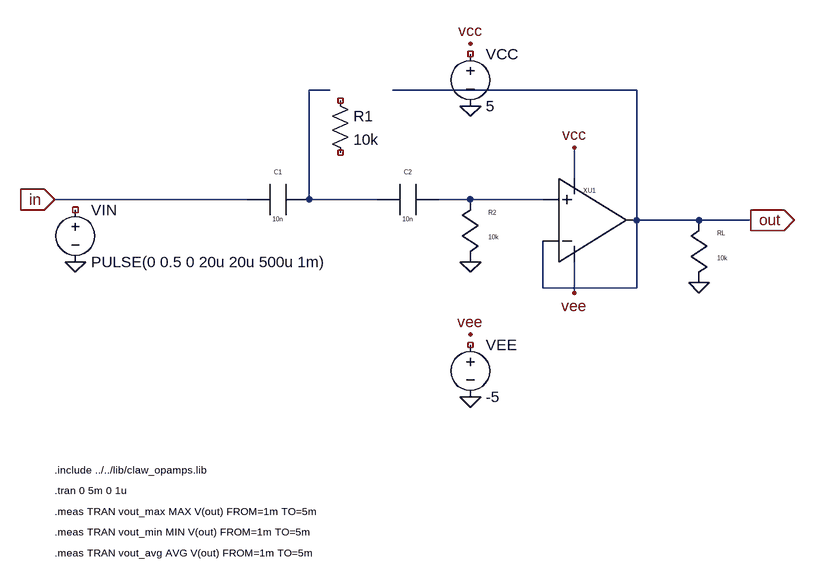
[diagram p0: schematic sallen_key_highpass.asc]
sallen_key_highpass.asc, the LTspice schematic file:
Version 4
SHEET 1 1357 1031
WIRE 64 304 360 304
WIRE 456 304 560 304
WIRE 656 304 816 304
WIRE 456 304 456 136
WIRE 456 136 488 136
WIRE 584 136 960 136
WIRE 960 136 960 336
WIRE 960 336 1136 336
WIRE 960 336 960 440
WIRE 960 440 816 440
WIRE 816 440 816 368
WIRE 864 272 864 224
WIRE 864 400 864 448
SYMBOL voltage 96 304 R0
SYMATTR InstName VIN
SYMATTR Value PULSE(0 0.5 0 20u 20u 500u 1m)
SYMBOL voltage 704 64 R0
SYMATTR InstName VCC
SYMATTR Value 5
SYMBOL voltage 704 512 R0
SYMATTR InstName VEE
SYMATTR Value -5
SYMBOL cap_h 360 304 R0
SYMATTR InstName C1
SYMATTR Value 10n
SYMBOL cap_h 560 304 R0
SYMATTR InstName C2
SYMATTR Value 10n
SYMBOL res 488 136 R0
SYMATTR InstName R1
SYMATTR Value 10k
SYMBOL res_v 704 304 R0
SYMATTR InstName R2
SYMATTR Value 10k
SYMBOL opamp2 816 272 R0
SYMATTR InstName XU1
SYMATTR Value CLAW_IDEAL_OPAMP
SYMBOL res_v 1056 336 R0
SYMATTR InstName RL
SYMATTR Value 10k
FLAG 64 304 in
IOPIN 64 304 In
FLAG 1136 336 out
IOPIN 1136 336 Out
FLAG 96 400 0
FLAG 704 400 0
FLAG 1056 432 0
FLAG 704 64 vcc
FLAG 704 160 0
FLAG 704 512 vee
FLAG 704 608 0
FLAG 864 224 vcc
FLAG 864 448 vee
TEXT 64 720 Left 1 !.include ../../lib/claw_opamps.lib
TEXT 64 752 Left 1 !.tran 0 5m 0 1u
TEXT 64 784 Left 1 !.meas TRAN vout_max MAX V(out) FROM=1m TO=5m
TEXT 64 816 Left 1 !.meas TRAN vout_min MIN V(out) FROM=1m TO=5m
TEXT 64 848 Left 1 !.meas TRAN vout_avg AVG V(out) FROM=1m TO=5m

The netlist it stands for:
* sallen_key_highpass.asc
VIN NC_01 0 PULSE(0 0.5 0 20u 20u 500u 1m)
VCC NC_02 0 5
VEE NC_03 0 -5
C1 in N001 10n
C2 N001 N002 10n
R1 NC_04 NC_05 10k
R2 N002 0 10k
XXU1 CLAW_IDEAL_OPAMP CLAW_IDEAL_OPAMP
RL out 0 10k
.include ../../lib/claw_opamps.lib
.tran 0 5m 0 1u
.meas TRAN vout_max MAX V(out) FROM=1m TO=5m
.meas TRAN vout_min MIN V(out) FROM=1m TO=5m
.meas TRAN vout_avg AVG V(out) FROM=1m TO=5m
.backanno
.end